# Altium schematic sheet DSO_Trig.SchDoc: Schematic_Name
size A4; CompanyName: University of Melbourne; Engineer: Your Name Here; DocumentNumber: 1; Revision: 0.1; SheetNumber: 1; SheetTotal: 1; Title_Project: Project_Title; StudentNo: Student No.
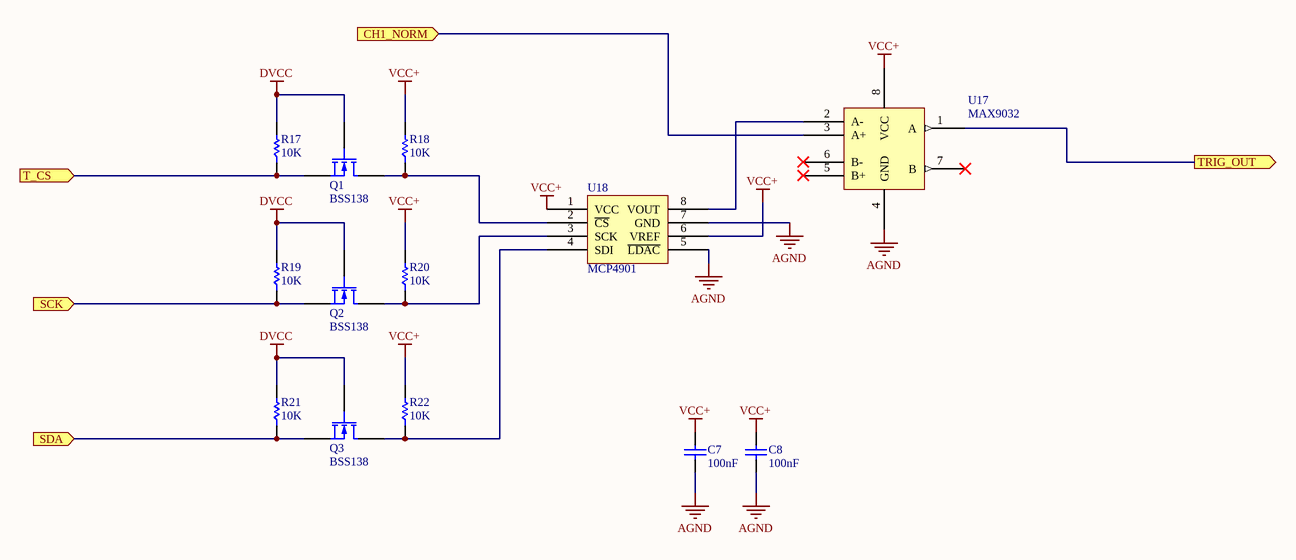
[diagram p0: DSO_Trig.SchDoc]

## Parts
C7  100nF  [0805C]
C8  100nF  [0805C]
Q1  BSS138  [SOT23]
Q2  BSS138  [SOT23]
Q3  BSS138  [SOT23]
R17  10K  [0805]
R18  10K  [0805]
R19  10K  [0805]
R20  10K  [0805]
R21  10K  [0805]
R22  10K  [0805]
U17  MAX9032  [SOIC-8]
U18  MCP4901  [SOIC-8]

## Ports
CH1_NORM (in), SCK (in), SDA (in), T_CS (in), TRIG_OUT (out)

## Nets
AGND: C7.2 C8.2 U17.4(GND) U18.5(~{LDAC}) U18.7(GND)
DVCC: Q1.1 Q2.1 Q3.1 R17.2 R19.2 R21.2
VCC+: C7.1 C8.1 R18.2 R20.2 R22.2 U17.8(VCC) U18.1(VCC) U18.6(VREF)
CH1_NORM: U17.3(A+) ; port CH1_NORM
SCK: Q2.2 R19.1 ; port SCK
SDA: Q3.2 R21.1 ; port SDA
T_CS: Q1.2 R17.1 ; port T_CS
TRIG_OUT: U17.1(A) ; port TRIG_OUT
NetQ1_3: Q1.3 R18.1 U18.2(~{CS})
NetQ2_3: Q2.3 R20.1 U18.3(SCK)
NetQ3_3: Q3.3 R22.1 U18.4(SDI)
NetU17_2: U17.2(A-) U18.8(VOUT)

Not connected (* = marked no-connect by the designer): U17 5(B+)* 6(B-)* 7(B)*

## Library data of the parts
C7 C8 = C: Capacitor; Reviewed by: RM - 2018/08/05; Revision: July-2002: Re-released for DXP Platform.; Supplier 1: *; Supplier Part Number 1: *; Value: 100nF
Q1-Q3 = MOSFET-N: N-Channel MOSFET; PackageDocument: 1995/1996; Published: 8-Jun-2000; LatestRevisionDate: 17-Jul-2002; LatestRevisionNote: Re-released for DXP Platform.; PackageReference: E3; Publisher: Altium Limited
R17-R22 = R: Resistor; Reviewed by: RM - 2018/08/05; Supplier 1: *; Suppler Part Number 1: *; Value: 10K
U17 = MAX9032: Dual Comparator; Reviewed by: RM - 2018/08/05; Supplier 1: Digi-Key; Supplier Part Number 1: MAX9032ASA-ND
U18 = MCP4901: DAC 8bit SPI; Reviewed by: RM - 2018/08/05; Supplier 1: Digi-Key; Supplier Part Number 1: MCP4901-E/SN-ND